# Altium schematic sheet Sheet1.schdoc: May Tho
size 292 x 193 mm; Address1: 11111; Parameter 2: haha
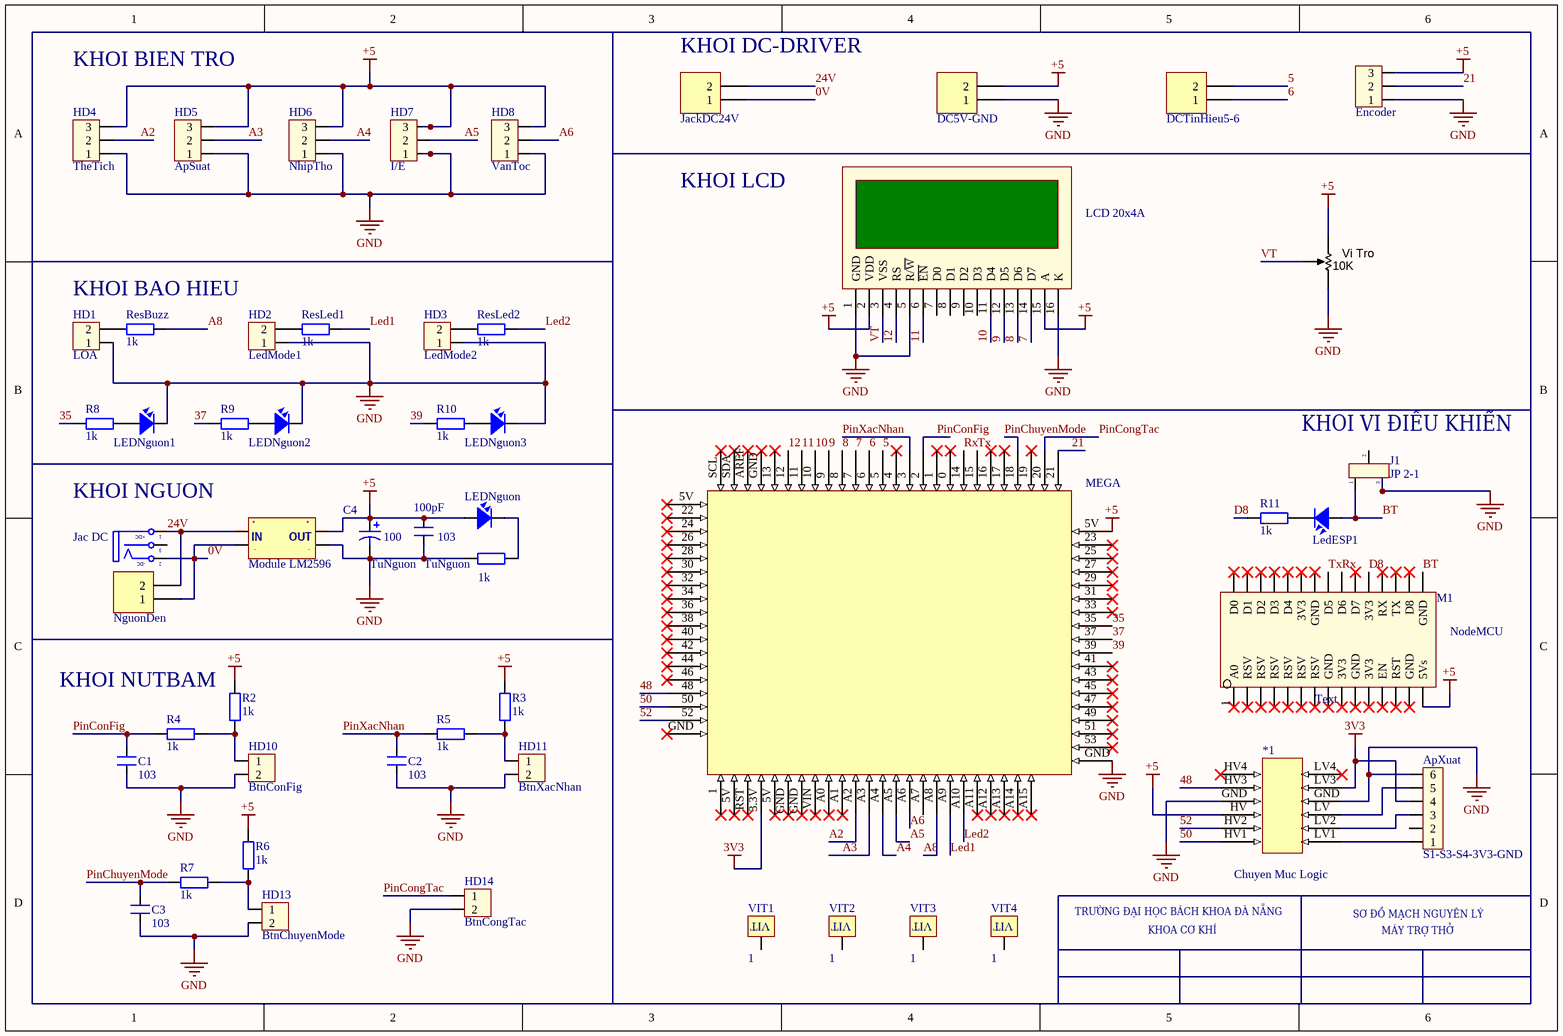
[diagram p0: Sheet1.schdoc]

## Parts
(Parts that share a designator on the sheet are numbered #1, #2 ... from top to bottom, then left to right.)
*1  Chuyen Muc Logic  [chuyen muc logic]
ApXuat  S1-S3-S4-3V3-GND  [Header_6]
C1  103  [CN1]
C2  103  [CN1]
C3  103  [CN1]
DC5V-GND  Header 2_1  [DOMINO_OSTTC_2P]  (value not drawn)
DCTinHieu5-6  Header 2_1  [DOMINO_OSTTC_2P]  (value not drawn)
HD1  LOA  [DOMINO_OSTTC_2P]
HD2  LedMode1  [DOMINO_OSTTC_2P]
HD3  LedMode2  [DOMINO_OSTTC_2P]
HD4  TheTich  [DOMINO_OSTTC_3P]
HD5  ApSuat  [DOMINO_OSTTC_3P]
HD6  NhipTho  [DOMINO_OSTTC_3P]
HD7  I/E  [DOMINO_OSTTC_3P]
HD8  VanToc  [DOMINO_OSTTC_3P]
HD9  Encoder  [DOMINO_OSTTC_3P]
HD10  BtnConFig  [DOMINO_OSTTC_2P]
HD11  BtnXacNhan  [DOMINO_OSTTC_2P]
HD13  BtnChuyenMode  [DOMINO_OSTTC_2P]
HD14  BtnCongTac  [DOMINO_OSTTC_2P]
J1  JP 2-1  [JP3]
JackDC24V  Header 2_1  [DOMINO_OSTTC_2P]  (value not drawn)
JDC  Jac DC  [DC-IN]
LCD  LCD 20x4A  [LCD20X4A]
LedESP1  LED  [LED-5-RED]  (value not drawn)
LEDNguon  LED  [LED-5-RED]  (value not drawn)
LEDNguon1  LED  [LED-5-RED]  (value not drawn)
LEDNguon2  LED  [LED-5-RED]  (value not drawn)
LEDNguon3  LED  [LED-5-RED]  (value not drawn)
M1#1  Module LM2596  [MODULE LM2596 MINI]
M1#2  NodeMCU  [NodeMCU ESP8266]
MEGA  MG?  [MEGA URDUINO]  (value not drawn)
NguonDen  Header 2_1  [DOMINO_OSTTC_2P]  (value not drawn)
R1  1k  [R1/4W]
R2  1k  [R1/4W]
R3  1k  [R1/4W]
R4  1k  [R1/4W]
R5  1k  [R1/4W]
R6  1k  [R1/4W]
R7  1k  [R1/4W]
R8  1k  [R1/4W]
R9  1k  [R1/4W]
R10  1k  [R1/4W]
R11  1k  [R1/4W]
ResBuzz  1k  [R1/4W]
ResLed1  1k  [R1/4W]
ResLed2  1k  [R1/4W]
TuNguon#1  100  value C4  [CP2/5]
TuNguon#2  103  value 100pF  [CN1]
Vi_Tro  value 10K  [VR1]  (hidden comment: 25 Turn)
VIT1  1  [VIT]
VIT2  1  [VIT]
VIT3  1  [VIT]
VIT4  1  [VIT]

## Nets
3V3: *1.LV3 ApXuat.4 MEGA.3.3V
+5: *1.HV DC5V-GND.2 HD4.3 HD5.3 HD6.3 HD7.3 HD8.3 HD9.3 LCD.2(VDD) LCD.15(A) LEDNguon.1 M1#1.3 M1#2.15(5Vs) MEGA.5V R2.2 R3.2 R6.2 TuNguon#1.1 TuNguon#2.2 Vi_Tro.1(CCW)
GND: *1.GND ApXuat.6 C1.1 C2.1 C3.1 DC5V-GND.1 HD1.1 HD2.1 HD3.1 HD4.1 HD5.1 HD6.1 HD7.1 HD8.1 HD9.1 HD10.2 HD11.2 HD13.2 HD14.2 J1.3 LCD.1(GND) LCD.5(R/~{W}) LCD.16(K) LEDNguon1.2 LEDNguon2.2 LEDNguon3.2 M1#1.4 MEGA.GND R1.1 TuNguon#1.2 TuNguon#2.1 Vi_Tro.3(CW)
0V: JackDC24V.1 JDC.2(TN) M1#1.2 NguonDen.1
5: DCTinHieu5-6.2 MEGA.5
6: DCTinHieu5-6.1 MEGA.6
7: LCD.14(D7) MEGA.7
8: LCD.13(D6) MEGA.8
9: LCD.12(D5) MEGA.9
10: LCD.11(D4) MEGA.10
11: LCD.6(~{EN}) MEGA.11
12: LCD.4(RS) MEGA.12
21: HD9.2 MEGA.21
24V: JackDC24V.2 JDC.1(T) M1#1.1 NguonDen.2
35: MEGA.35 R8.1
37: MEGA.37 R9.1
39: MEGA.39 R10.1
48: *1.HV3 MEGA.48
50: *1.HV1 MEGA.50
52: *1.HV2 MEGA.52
A2: HD4.2 MEGA.A2
A3: HD5.2 MEGA.A3
A4: HD6.2 MEGA.A4
A5: HD7.2 MEGA.A5
A6: HD8.2 MEGA.A6
A8: MEGA.A8 ResBuzz.2
BT: J1.1 LedESP1.1 M1#2.17(GND)
D8: M1#2.16(3V3) R11.2
Led1: MEGA.A9 ResLed1.2
Led2: MEGA.A10 ResLed2.2
PinChuyenMode: C3.2 MEGA.18 R7.1
PinConFig: C1.2 MEGA.2 R4.1
PinCongTac: HD14.1 MEGA.20
PinXacNhan: C2.2 MEGA.3 R5.1
Rx: M1#2.22(D6) MEGA.14
Tx: M1#2.23(D5) MEGA.15
VT: LCD.3(VSS) Vi_Tro.2(TAP)
Net*1_LV: *1.LV ApXuat.5
Net*1_LV1: *1.LV1 ApXuat.1
Net*1_LV2: *1.LV2 ApXuat.3
NetHD1_2: HD1.2 ResBuzz.1
NetHD2_2: HD2.2 ResLed1.1
NetHD3_2: HD3.2 ResLed2.1
NetHD10_1: HD10.1 R2.1 R4.2
NetHD11_1: HD11.1 R3.1 R5.2
NetHD13_1: HD13.1 R6.1 R7.2
NetLedESP1_2: LedESP1.2 R11.1
NetLEDNguon1_1: LEDNguon1.1 R8.2
NetLEDNguon2_1: LEDNguon2.1 R9.2
NetLEDNguon3_1: LEDNguon3.1 R10.2
NetLEDNguon_2: LEDNguon.2 R1.2

Not connected (* = marked no-connect by the designer): *1 HV4* LV4*; ApXuat 2; J1 2; JDC 3(S); LCD 7(D0) 8(D1) 9(D2) 10(D3); M1#2 1(A0)* 2(RSV)* 3(RSV)* 4(RSV)* 5(RSV)* 6(RSV)* 7(RSV)* 8(GND)* 9(3V3)* 10(GND)* 11(3V3)* 12(EN)* 13(RST)* 14(GND)* 18(TX)* 19(RX)* 20(D8)* 21(D7)* 24(GND)* 25(3V3)* 26(D4)* 27(D3)* 28(D2)* 29(D1)* 30(D0)*; MEGA 0* 1* 4* 13* 16* 17* 19* 22* 23* 24* 25* 26* 27* 28* 29* 30* 31* 32* 33* 34* 36* 38* 40* 41* 42* 43* 44* 45* 46* 47* 49* 51* 53* A0* A1* A7 A11* A12* A13* A14* A15* AREF* RST* SCL* SDA* VIN*; VIT1 VIT1(1); VIT2 VIT1(1); VIT3 VIT1(1); VIT4 VIT1(1)

## Notes on the sheet
- KHOI BIEN TRO
- (near JackDC24V) KHOI DC-DRIVER
- KHOI LCD
- KHOI BAO HIEU
- (near J1) KHOI VI ĐIỀU KHIỂN
- (near JDC) KHOI NGUON
- KHOI NUTBAM
- (near M1#2) Text
- TRƯỜNG ĐẠI HỌC BÁCH KHOA ĐÀ NẴNG
- SƠ ĐỒ MẠCH NGUYÊN LÝ
- KHOA CƠ KHÍ
- MÁY TRỢ THỞ
- (in symbol DCIN) +DC; -DC
- (in symbol Module LM2596 Mini) +; IN; OUT; -

## Library data of the parts
ApXuat = Header6: Header 6; Creat by: VanDungEvn@Gmail.com
C1-C3 = CN1: Cap np  1pF - 472pF; Value: 100pF
DC5V-GND DCTinHieu5-6 JackDC24V NguonDen = Header 2_1: Header, 2-Pin; Manufacturer: Generic Components; Class: Connector; Value: Header 2
HD1-HD3 HD10 HD11 HD13 HD14 = Hed2: Header 2 (Green); Value: Header 2
HD4-HD9 = Hed3: Header 3 (Green); Value: Header 3
J1 = JP 2-1: Jumper 2-1; Value: J2-1
JDC = DCIN: Jac DC input; Value: Jac DC
LCD = LCD20x4A: LCD dipslay 20 char, 4 line; Value: Jum 40; Value: LCD 20x4A
LedESP1 LEDNguon LEDNguon1-LEDNguon3 = LED: LED Single colour Green and Red; Value: LED 3 ly Single Colour
M1#1 = Module LM2596 Mini
M1#2 = NodeMCU ESP8266
MEGA = mega urduino
R1-R11 ResBuzz ResLed1 ResLed2 = R1/4W: Resistor 1/4W; Value: R1/4W - 1K
TuNguon#1 = Cap Pol3: Polarized Capacitor (Surface Mount); 100: 1000pF/35V; LatestRevisionDate: 17-Jul-2002; LatestRevisionNote: Re-released for DXP Platform.; PackageReference: C0805; Publisher: Altium Limited
TuNguon#2 = CN1: Cap np  1pF - 472pF
Vi_Tro = RES_TRIMMER_1K_25T_THT: Trimmer, 25-Turn, 1K cermet; Manufacturer 1: Murata Electronics North America; Manufacturer Part Number 1: PV36Y102C01B00; Tolerance: 10%; Ratings: 25 turn variable cermet; SCDType: spec; Supplier 1: Digi-Key; Supplier Part Number 1: 490-2912-ND
VIT1-VIT4 = VIT: Oc Vit